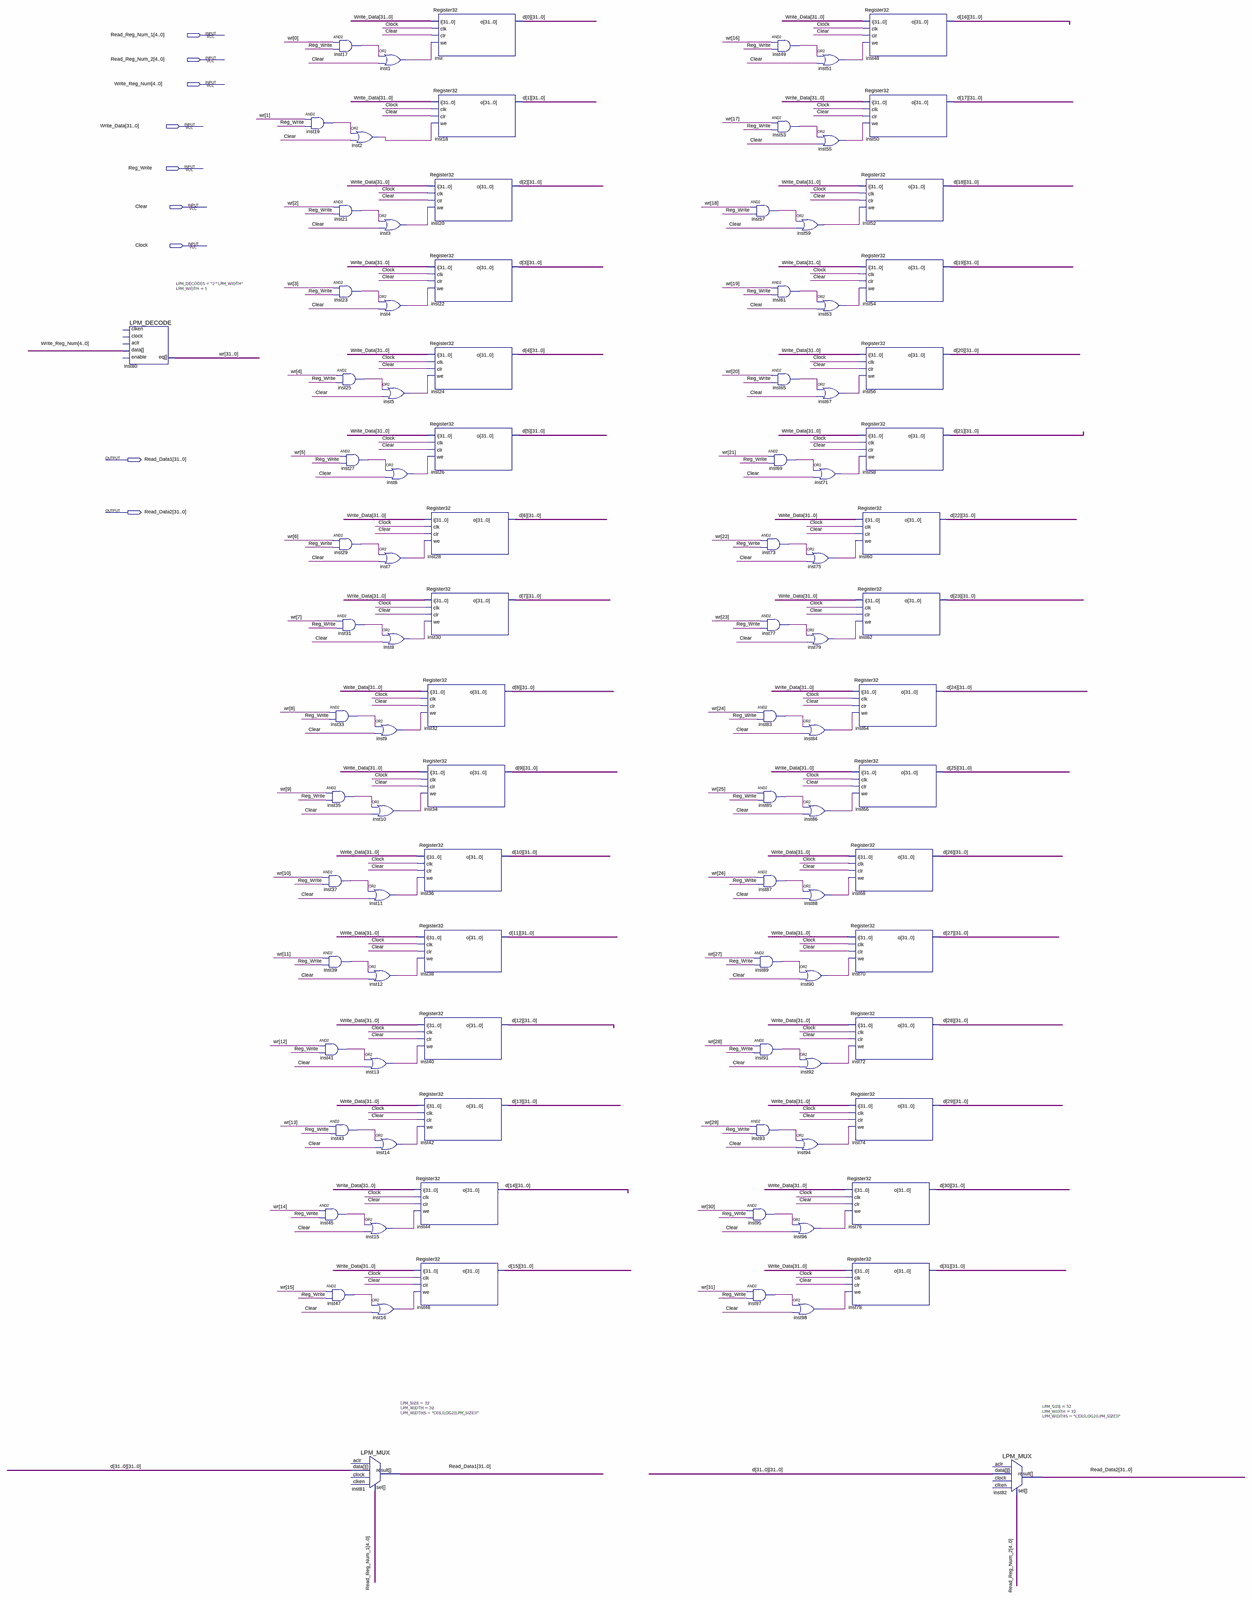
[diagram p0: schematic sheet, whole]
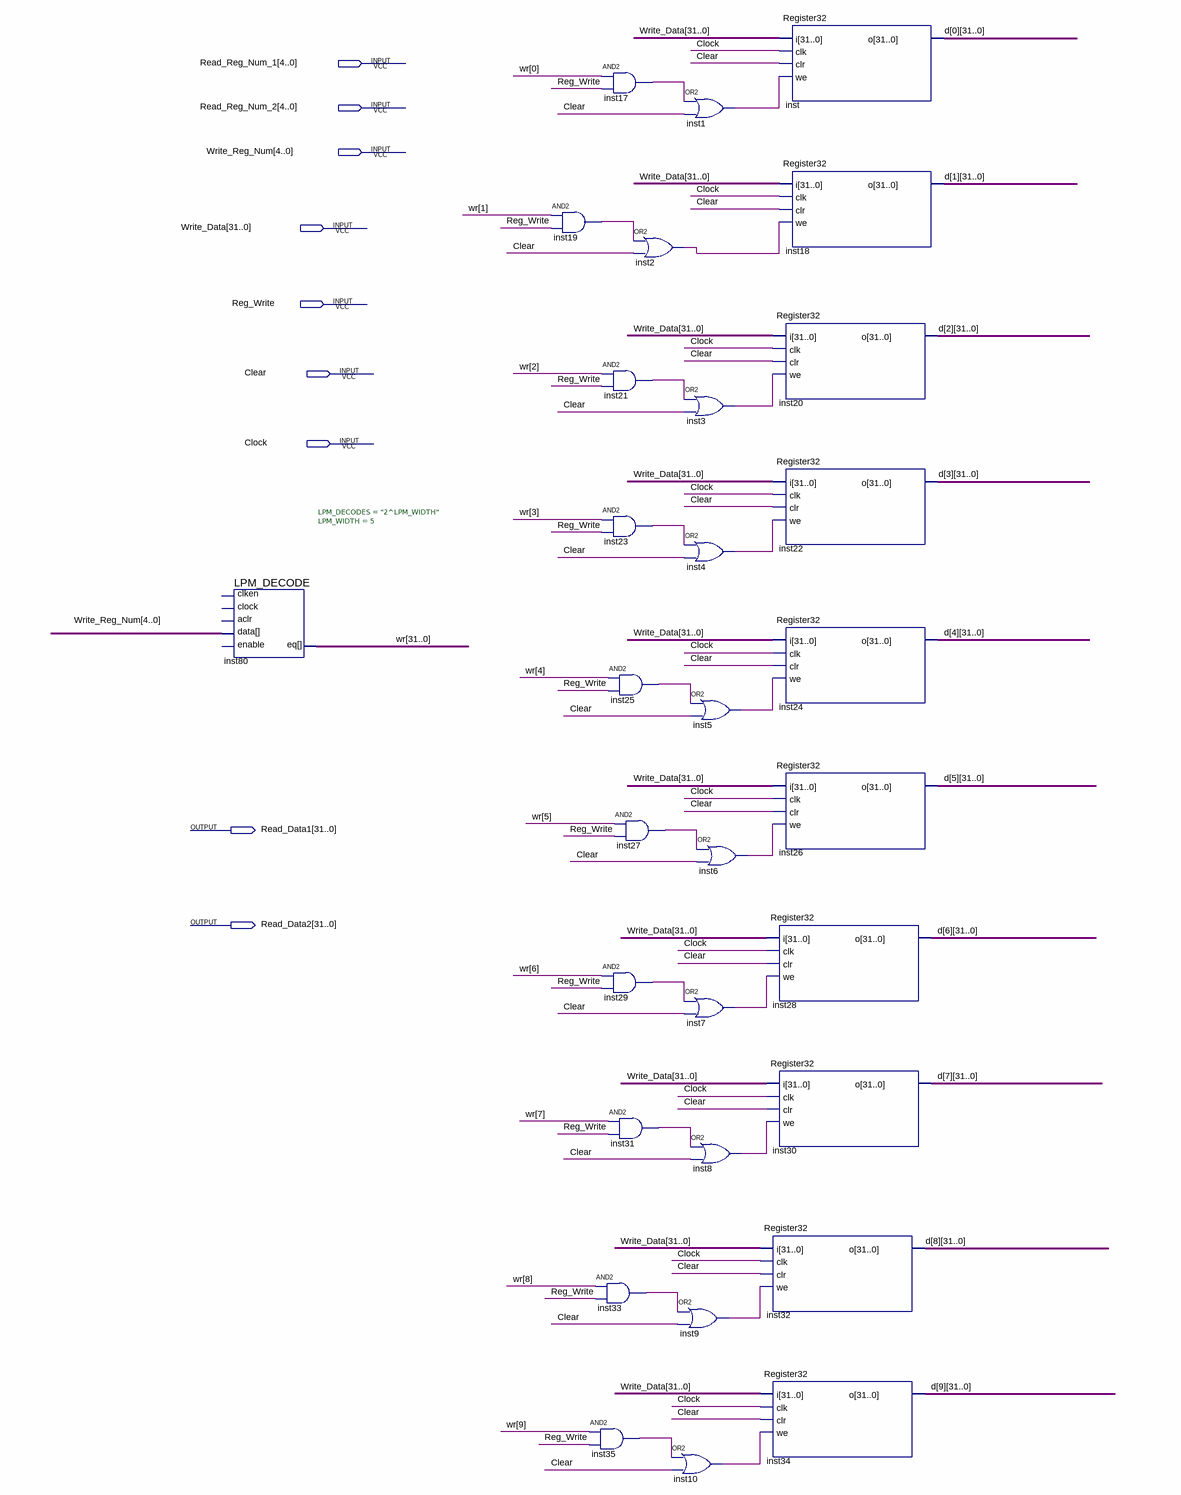
[diagram p1: schematic sheet, upper left part]
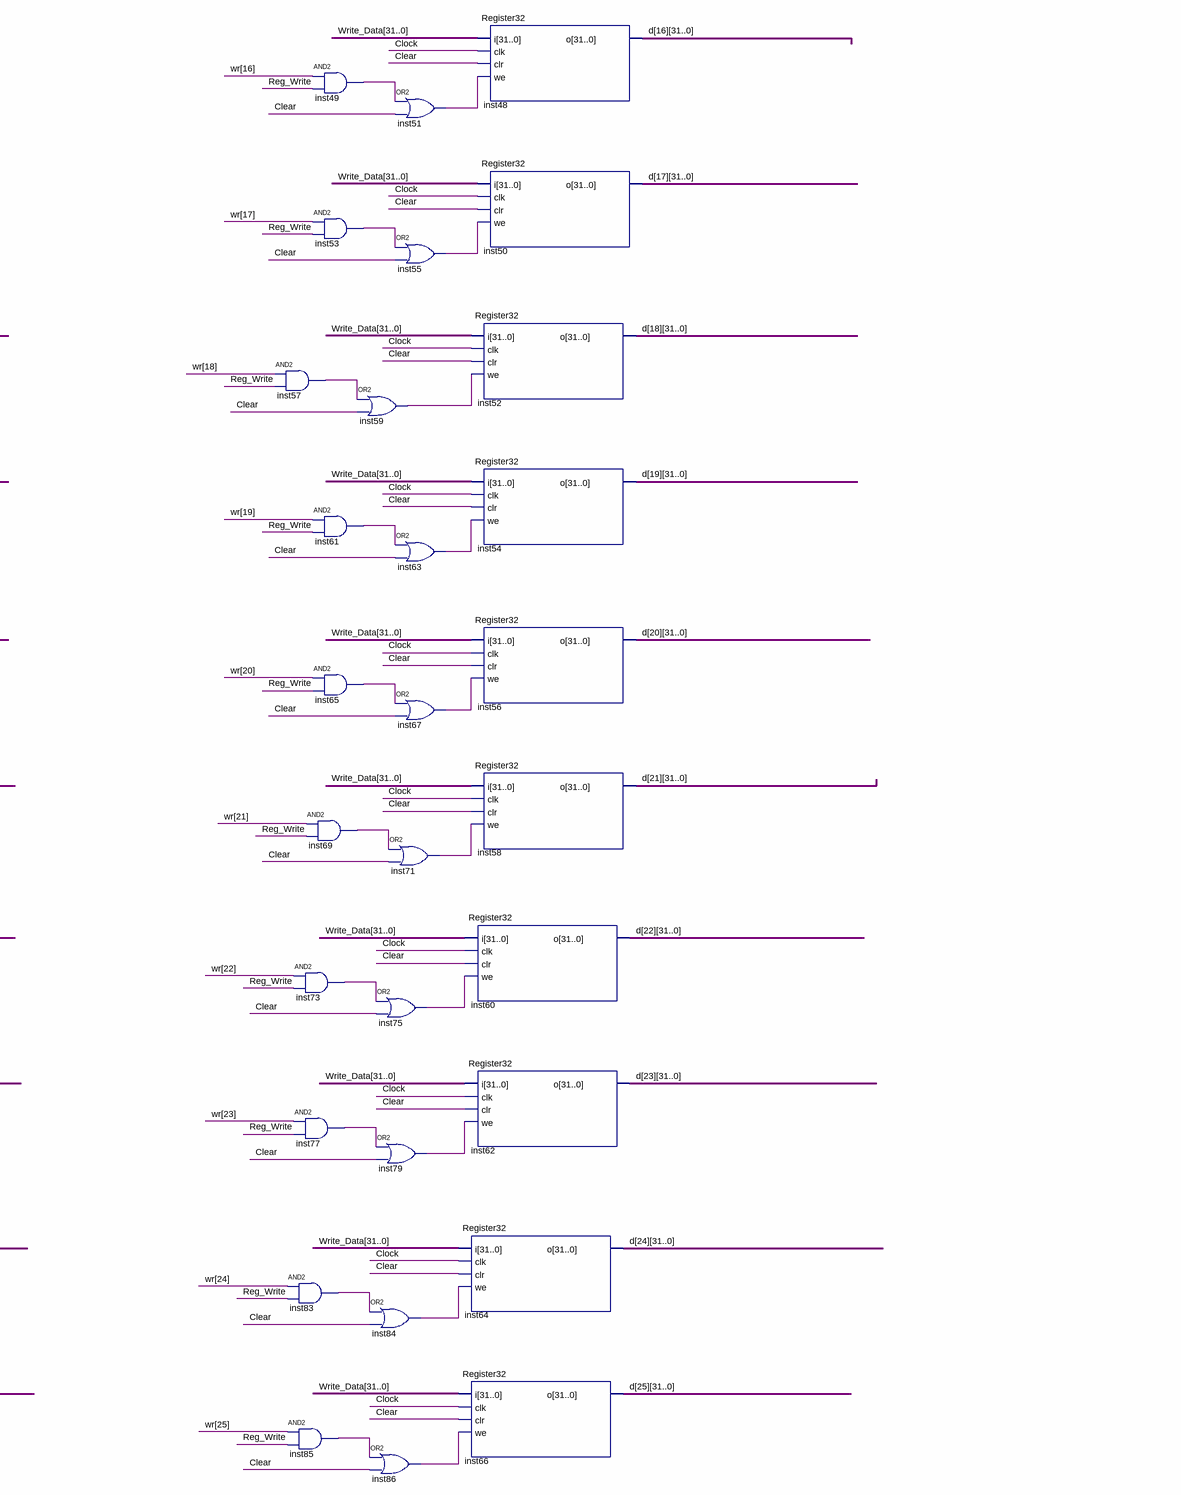
[diagram p2: schematic sheet, upper right part]
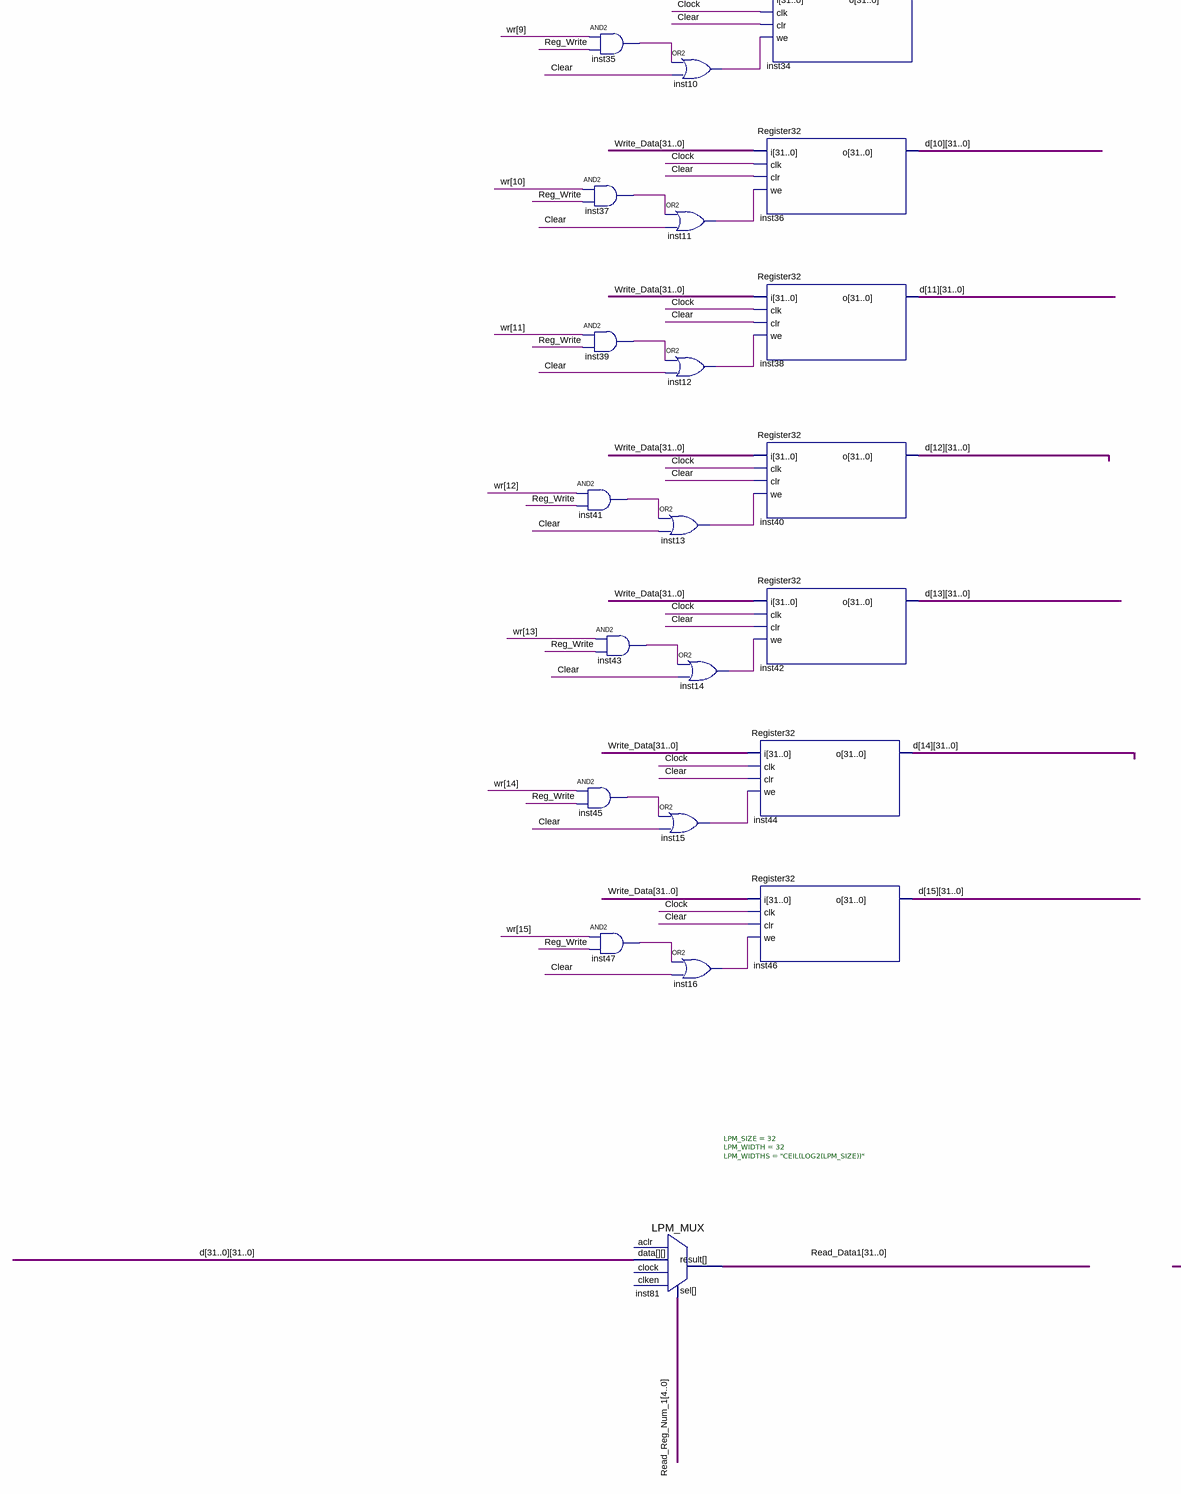
[diagram p3: schematic sheet, lower left part]
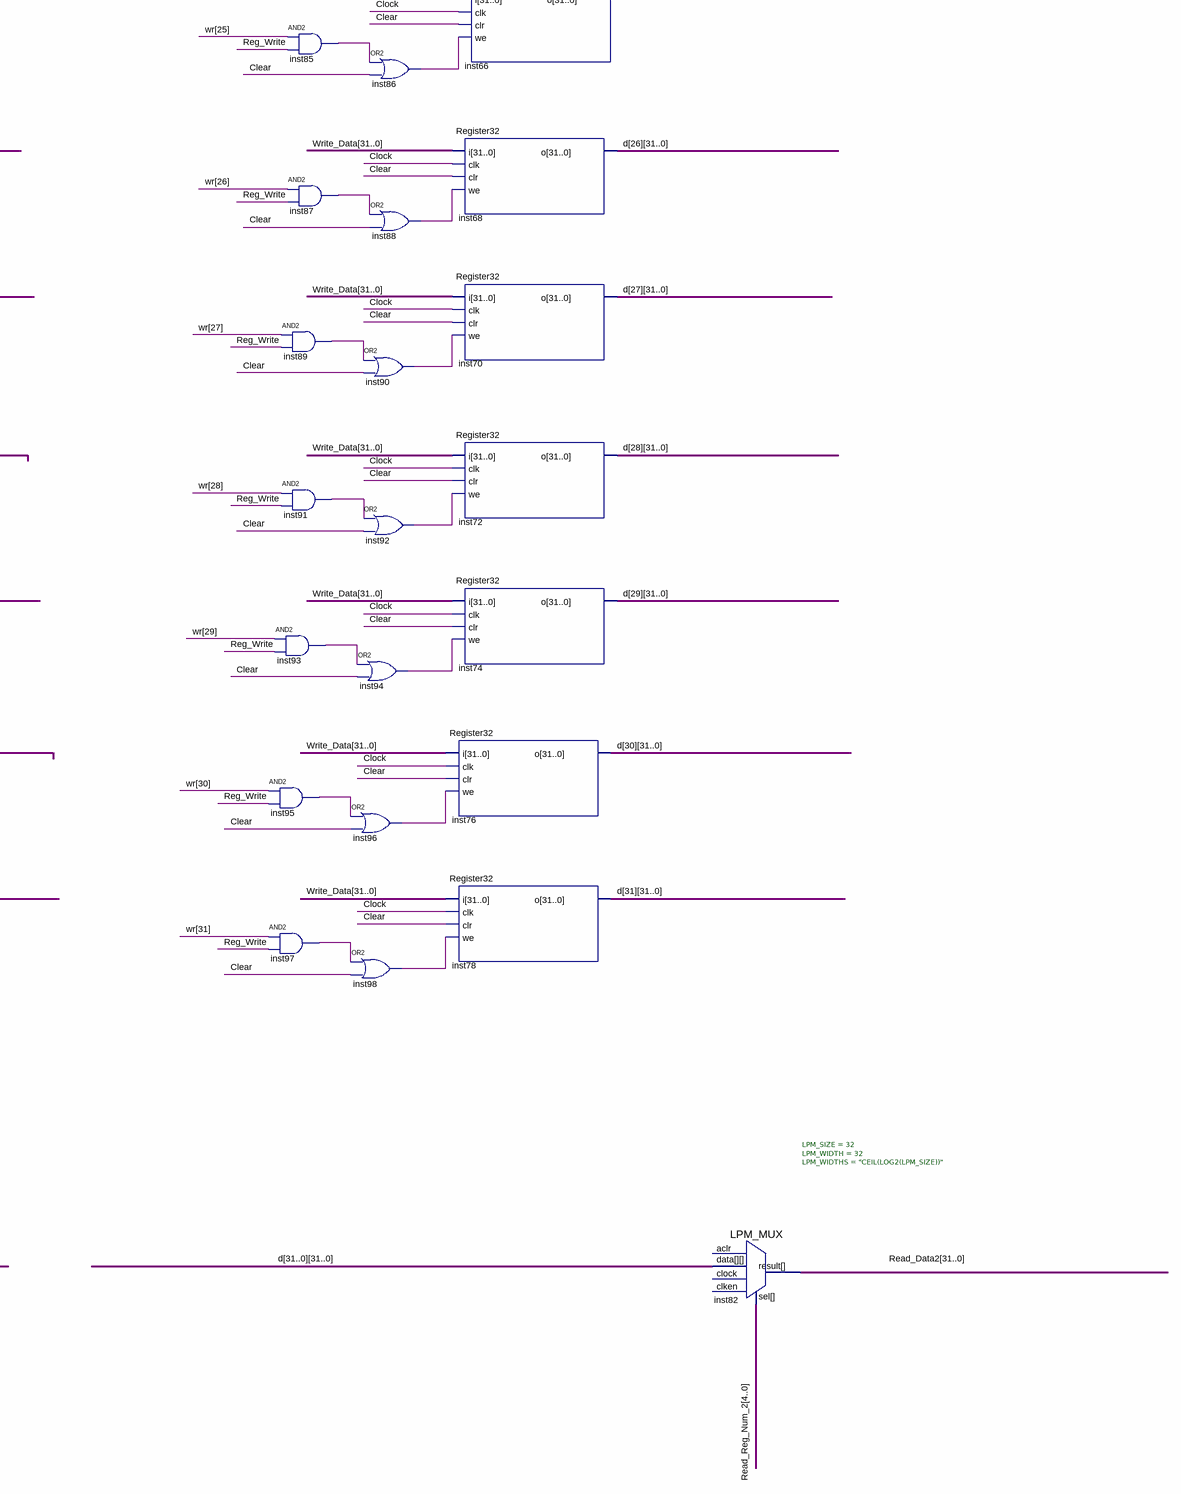
[diagram p4: schematic sheet, lower right part]
// Quartus schematic Register_File.bdf as structural Verilog: 99 symbols, 9 pins
module Register_File (
  input  [4:0] Read_Reg_Num_1,
  input  [4:0] Read_Reg_Num_2,
  input  [4:0] Write_Reg_Num,
  input  [31:0] Write_Data,
  input  Reg_Write,
  input  Clear,
  input  Clock,
  output [31:0] Read_Data1,
  output [31:0] Read_Data2
);

  wire inst1_out, inst2_out, inst3_out, inst4_out, inst5_out, inst6_out, inst7_out, inst8_out, inst9_out,
       inst10_out, inst11_out, inst12_out, inst13_out, inst14_out, inst15_out, inst16_out, inst17_out,
       inst19_out, inst21_out, inst23_out, inst25_out, inst27_out, inst29_out, inst31_out, inst33_out,
       inst35_out, inst37_out, inst39_out, inst41_out, inst43_out, inst45_out, inst47_out, inst49_out,
       inst51_out, inst53_out, inst55_out, inst57_out, inst59_out, inst61_out, inst63_out, inst65_out,
       inst67_out, inst69_out, inst71_out, inst73_out, inst75_out, inst77_out, inst79_out, inst83_out,
       inst84_out, inst85_out, inst86_out, inst87_out, inst88_out, inst89_out, inst90_out, inst91_out,
       inst92_out, inst93_out, inst94_out, inst95_out, inst96_out, inst97_out, inst98_out;
  wire [31:0] d_0, d_1, d_2, d_3, d_4, d_5, d_6, d_7, d_8, d_9, d_10, d_11, d_12, d_13, d_14, d_15, d_16,
       d_17, d_18, d_19, d_20, d_21, d_22, d_23, d_24, d_25, d_26, d_27, d_28, d_29, d_30, d_31, wr;

  LPM_DECODE #(.LPM_DECODES("2^LPM_WIDTH"), .LPM_WIDTH(5)) inst80 (
    .data(Write_Reg_Num), .eq(wr));  // open: enable, clken, clock, aclr
  and inst19 (inst19_out, wr[1], Reg_Write);
  and inst35 (inst35_out, wr[9], Reg_Write);
  and inst37 (inst37_out, wr[10], Reg_Write);
  and inst39 (inst39_out, wr[11], Reg_Write);
  and inst41 (inst41_out, wr[12], Reg_Write);
  and inst45 (inst45_out, wr[14], Reg_Write);
  and inst47 (inst47_out, wr[15], Reg_Write);
  and inst17 (inst17_out, wr[0], Reg_Write);
  or inst2 (inst2_out, inst19_out, Clear);
  and inst21 (inst21_out, wr[2], Reg_Write);
  and inst23 (inst23_out, wr[3], Reg_Write);
  and inst25 (inst25_out, wr[4], Reg_Write);
  and inst27 (inst27_out, wr[5], Reg_Write);
  and inst29 (inst29_out, wr[6], Reg_Write);
  and inst31 (inst31_out, wr[7], Reg_Write);
  and inst33 (inst33_out, wr[8], Reg_Write);
  and inst43 (inst43_out, wr[13], Reg_Write);
  LPM_MUX #(.LPM_SIZE(32), .LPM_WIDTH(32), .LPM_WIDTHS("CEIL(LOG2(LPM_SIZE))")) inst81 (
    .data({d_31, d_30, d_29, d_28, d_27, d_26, d_25, d_24, d_23, d_22, d_21, d_20, d_19, d_18, d_17, d_16, d_15, d_14, d_13, d_12, d_11, d_10, d_9, d_8, d_7, d_6, d_5, d_4, d_3, d_2, d_1, d_0}),
    .sel(Read_Reg_Num_1), .result(Read_Data1));  // open: clock, aclr, clken
  or inst1 (inst1_out, inst17_out, Clear);
  or inst3 (inst3_out, inst21_out, Clear);
  or inst4 (inst4_out, inst23_out, Clear);
  or inst5 (inst5_out, inst25_out, Clear);
  or inst7 (inst7_out, inst29_out, Clear);
  or inst8 (inst8_out, inst31_out, Clear);
  or inst9 (inst9_out, inst33_out, Clear);
  or inst10 (inst10_out, inst35_out, Clear);
  or inst11 (inst11_out, inst37_out, Clear);
  or inst12 (inst12_out, inst39_out, Clear);
  or inst13 (inst13_out, inst41_out, Clear);
  or inst14 (inst14_out, inst43_out, Clear);
  or inst15 (inst15_out, inst45_out, Clear);
  or inst16 (inst16_out, inst47_out, Clear);
  or inst6 (inst6_out, inst27_out, Clear);
  Register32 inst (.i(Write_Data), .clk(Clock), .clr(Clear), .we(inst1_out), .o(d_0));
  Register32 inst18 (.i(Write_Data), .clk(Clock), .clr(Clear), .we(inst2_out), .o(d_1));
  Register32 inst20 (.i(Write_Data), .clk(Clock), .clr(Clear), .we(inst3_out), .o(d_2));
  Register32 inst22 (.i(Write_Data), .clk(Clock), .clr(Clear), .we(inst4_out), .o(d_3));
  Register32 inst24 (.i(Write_Data), .clk(Clock), .clr(Clear), .we(inst5_out), .o(d_4));
  Register32 inst26 (.i(Write_Data), .clk(Clock), .clr(Clear), .we(inst6_out), .o(d_5));
  Register32 inst28 (.i(Write_Data), .clk(Clock), .clr(Clear), .we(inst7_out), .o(d_6));
  Register32 inst30 (.i(Write_Data), .clk(Clock), .clr(Clear), .we(inst8_out), .o(d_7));
  Register32 inst32 (.i(Write_Data), .clk(Clock), .clr(Clear), .we(inst9_out), .o(d_8));
  Register32 inst34 (.i(Write_Data), .clk(Clock), .clr(Clear), .we(inst10_out), .o(d_9));
  Register32 inst36 (.i(Write_Data), .clk(Clock), .clr(Clear), .we(inst11_out), .o(d_10));
  Register32 inst38 (.i(Write_Data), .clk(Clock), .clr(Clear), .we(inst12_out), .o(d_11));
  Register32 inst40 (.i(Write_Data), .clk(Clock), .clr(Clear), .we(inst13_out), .o(d_12));
  Register32 inst42 (.i(Write_Data), .clk(Clock), .clr(Clear), .we(inst14_out), .o(d_13));
  Register32 inst44 (.i(Write_Data), .clk(Clock), .clr(Clear), .we(inst15_out), .o(d_14));
  Register32 inst46 (.i(Write_Data), .clk(Clock), .clr(Clear), .we(inst16_out), .o(d_15));
  and inst95 (inst95_out, wr[30], Reg_Write);
  and inst97 (inst97_out, wr[31], Reg_Write);
  and inst49 (inst49_out, wr[16], Reg_Write);
  and inst53 (inst53_out, wr[17], Reg_Write);
  and inst57 (inst57_out, wr[18], Reg_Write);
  and inst61 (inst61_out, wr[19], Reg_Write);
  and inst65 (inst65_out, wr[20], Reg_Write);
  and inst69 (inst69_out, wr[21], Reg_Write);
  and inst73 (inst73_out, wr[22], Reg_Write);
  and inst77 (inst77_out, wr[23], Reg_Write);
  and inst83 (inst83_out, wr[24], Reg_Write);
  and inst85 (inst85_out, wr[25], Reg_Write);
  and inst87 (inst87_out, wr[26], Reg_Write);
  and inst89 (inst89_out, wr[27], Reg_Write);
  and inst91 (inst91_out, wr[28], Reg_Write);
  and inst93 (inst93_out, wr[29], Reg_Write);
  or inst59 (inst59_out, inst57_out, Clear);
  or inst84 (inst84_out, inst83_out, Clear);
  or inst86 (inst86_out, inst85_out, Clear);
  or inst88 (inst88_out, inst87_out, Clear);
  or inst90 (inst90_out, inst89_out, Clear);
  or inst92 (inst92_out, inst91_out, Clear);
  or inst94 (inst94_out, inst93_out, Clear);
  or inst96 (inst96_out, inst95_out, Clear);
  or inst98 (inst98_out, inst97_out, Clear);
  or inst51 (inst51_out, inst49_out, Clear);
  or inst55 (inst55_out, inst53_out, Clear);
  or inst63 (inst63_out, inst61_out, Clear);
  or inst67 (inst67_out, inst65_out, Clear);
  or inst71 (inst71_out, inst69_out, Clear);
  or inst75 (inst75_out, inst73_out, Clear);
  or inst79 (inst79_out, inst77_out, Clear);
  Register32 inst52 (.i(Write_Data), .clk(Clock), .clr(Clear), .we(inst59_out), .o(d_18));
  Register32 inst54 (.i(Write_Data), .clk(Clock), .clr(Clear), .we(inst63_out), .o(d_19));
  Register32 inst56 (.i(Write_Data), .clk(Clock), .clr(Clear), .we(inst67_out), .o(d_20));
  Register32 inst58 (.i(Write_Data), .clk(Clock), .clr(Clear), .we(inst71_out), .o(d_21));
  Register32 inst60 (.i(Write_Data), .clk(Clock), .clr(Clear), .we(inst75_out), .o(d_22));
  Register32 inst62 (.i(Write_Data), .clk(Clock), .clr(Clear), .we(inst79_out), .o(d_23));
  Register32 inst64 (.i(Write_Data), .clk(Clock), .clr(Clear), .we(inst84_out), .o(d_24));
  Register32 inst66 (.i(Write_Data), .clk(Clock), .clr(Clear), .we(inst86_out), .o(d_25));
  Register32 inst68 (.i(Write_Data), .clk(Clock), .clr(Clear), .we(inst88_out), .o(d_26));
  Register32 inst70 (.i(Write_Data), .clk(Clock), .clr(Clear), .we(inst90_out), .o(d_27));
  Register32 inst72 (.i(Write_Data), .clk(Clock), .clr(Clear), .we(inst92_out), .o(d_28));
  Register32 inst74 (.i(Write_Data), .clk(Clock), .clr(Clear), .we(inst94_out), .o(d_29));
  Register32 inst76 (.i(Write_Data), .clk(Clock), .clr(Clear), .we(inst96_out), .o(d_30));
  Register32 inst78 (.i(Write_Data), .clk(Clock), .clr(Clear), .we(inst98_out), .o(d_31));
  Register32 inst48 (.i(Write_Data), .clk(Clock), .clr(Clear), .we(inst51_out), .o(d_16));
  Register32 inst50 (.i(Write_Data), .clk(Clock), .clr(Clear), .we(inst55_out), .o(d_17));
  LPM_MUX #(.LPM_SIZE(32), .LPM_WIDTH(32), .LPM_WIDTHS("CEIL(LOG2(LPM_SIZE))")) inst82 (
    .data({d_31, d_30, d_29, d_28, d_27, d_26, d_25, d_24, d_23, d_22, d_21, d_20, d_19, d_18, d_17, d_16, d_15, d_14, d_13, d_12, d_11, d_10, d_9, d_8, d_7, d_6, d_5, d_4, d_3, d_2, d_1, d_0}),
    .sel(Read_Reg_Num_2), .result(Read_Data2));  // open: clock, aclr, clken
endmodule
